# EAGLE design transmitter (EAGLE 6.2)
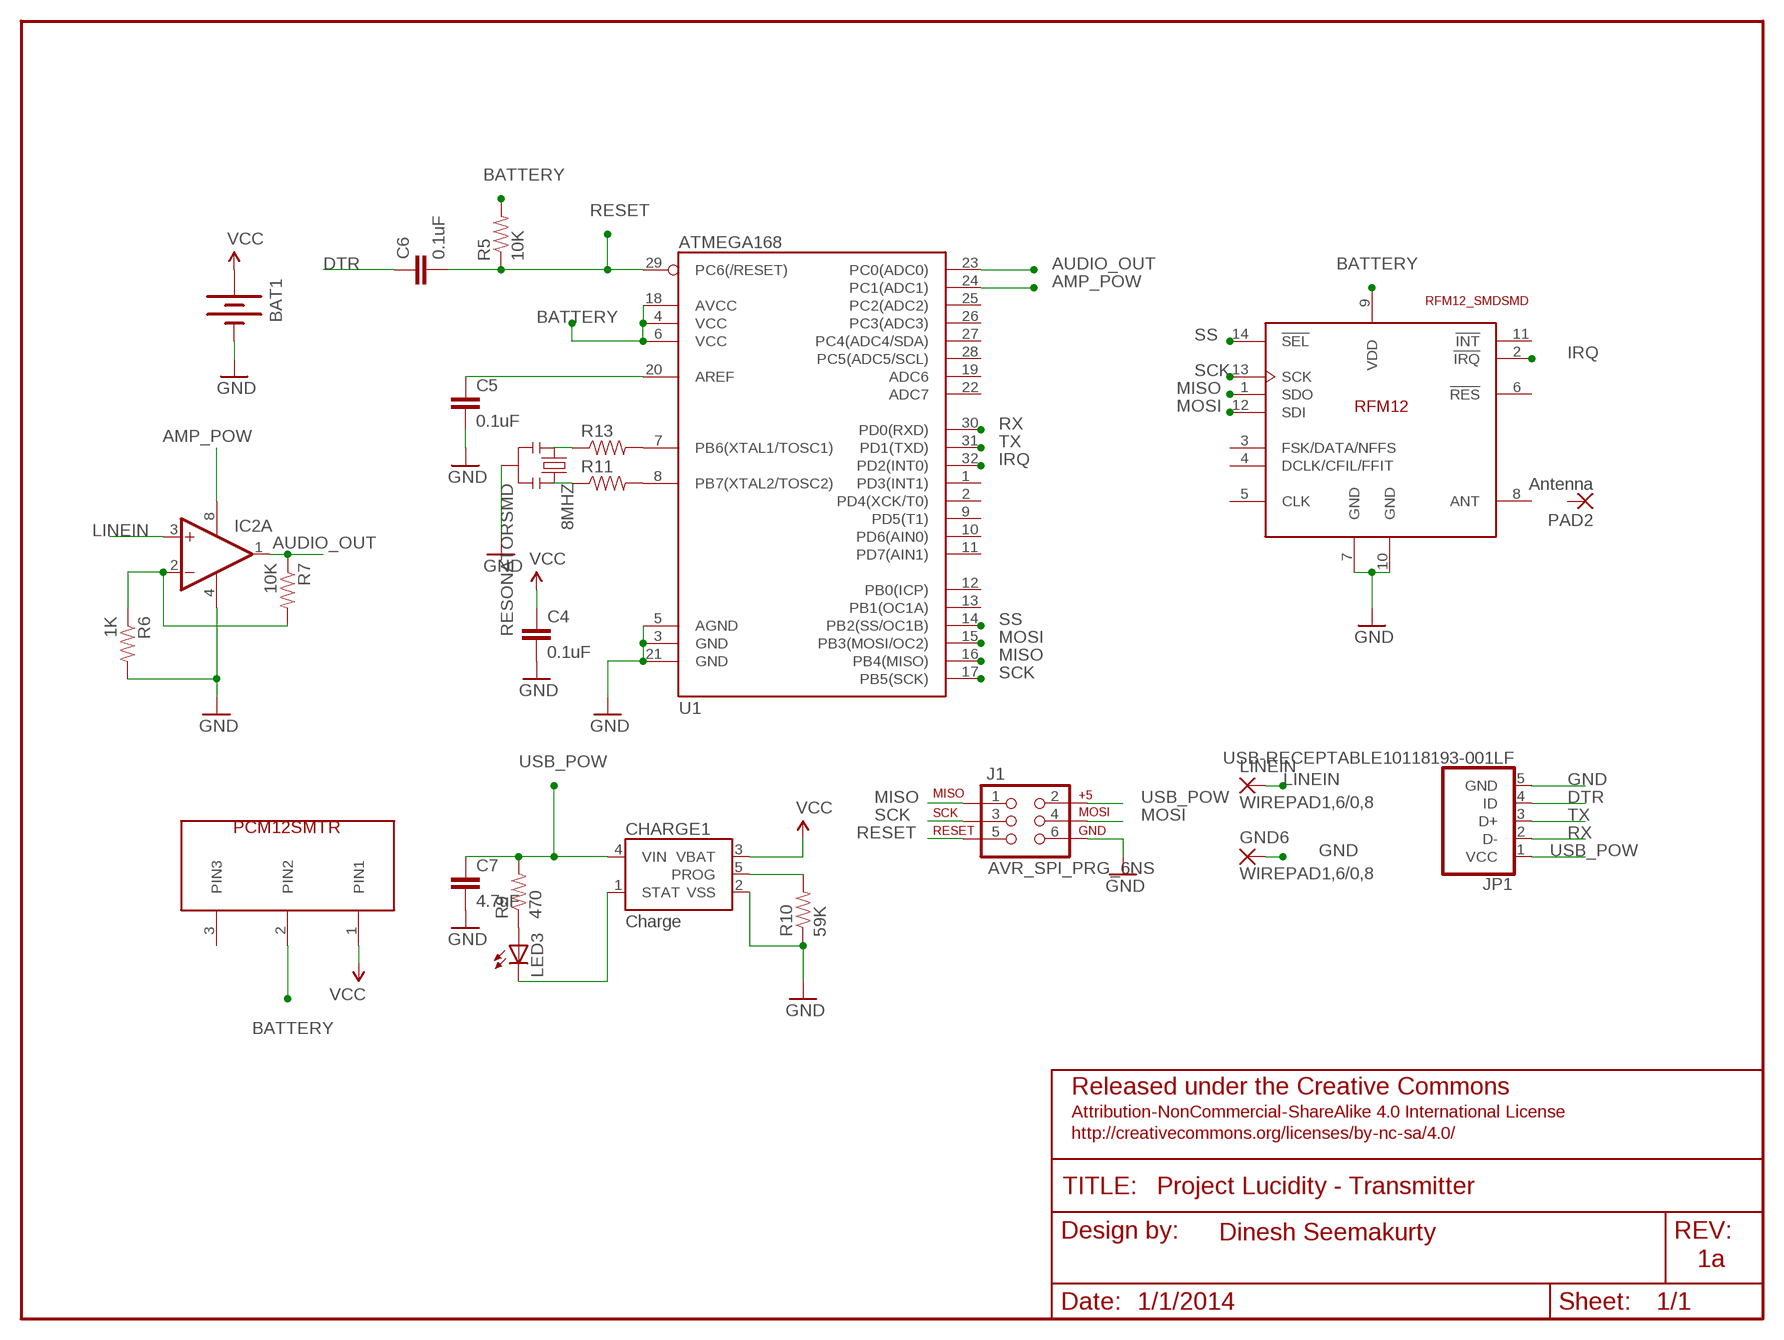
[diagram p0: schematic, sheet 1]

## Parts
8MHZ  RESONATORSMD  [RESONATOR-SMD]
BAT1  BATTERY20MM_4LEGS  [BATTCON_20MM_4LEGS]
C4  0.1uF  CAP0805  [0805]
C5  0.1uF  CAP0805  [0805]
C6  0.1uF  CAP0805  [0805]
C7  4.7uF  CAP0805  [0805]
CHARGE1  Charge  MCP73831  [SOT23-5]
FRAME1  FRAME-LETTER  [CREATIVE_COMMONS]
GND6  WIREPAD1,6/0,8  [1,6/0,8]
IC2  LM358D  [SO08]
J1  AVR_SPI_PRG_6NS  [2X3-NS]
JP1  USB-RECEPTABLE10118193-001LF  [FCI-10118193-0001LF]
LED3  LED0603  [LED-0603]
LINEIN  WIREPAD1,6/0,8  [1,6/0,8]
PAD2  Antenna  WIREPADSMD1,27-254  [SMD1,27-2,54]
R5  10K  RESISTOR0805-RES  [0805]
R6  1K  RESISTOR0805-RES  [0805]
R7  10K  RESISTOR0805-RES  [0805]
R9  470  RESISTOR0805-RES  [0805]
R10  59K  RESISTOR0805-RES  [0805]
R11  RESISTOR0402-RES  [0402-RES]
R13  RESISTOR0402-RES  [0402-RES]
U1  ATMEGA168  [TQFP32-08]
U$2  PCM12SMTR  [PCM12SMTR]
U$3  RFM12_SMDSMD  [RFM12]

## Nets
AMP_POW: IC2.8(P:V+) U1.24(PC1(ADC1))
AUDIO_OUT: IC2.1(A:OUT) R7.1 U1.23(PC0(ADC0))
BATTERY: R5.2 U1.4(VCC) U1.6(VCC) U1.18(AVCC) U$2.2(PIN2) U$3.9(VDD)
DTR: C6.1 JP1.4(ID)
GND: 8MHZ.2 BAT1.GND(-) C4.2 C5.2 C7.2 CHARGE1.2(VSS) GND6.1(P) IC2.4(P:V-) J1.6 JP1.5(GND) R6.2 R10.1 U1.3(GND) U1.5(AGND) U1.21(GND) U$3.7(GND) U$3.10(GND)
IRQ: U1.32(PD2(INT0)) U$3.2(!IRQ)
LINEIN: IC2.3(A:+IN) LINEIN.1(P)
MISO: J1.1 U1.16(PB4(MISO)) U$3.1(SDO)
MOSI: J1.4 U1.15(PB3(MOSI/OC2)) U$3.12(SDI)
N$1: R13.2 U1.7(PB6(XTAL1/TOSC1))
N$15: C5.1 U1.20(AREF)
N$25: R11.2 U1.8(PB7(XTAL2/TOSC2))
N$26: LED3.A R9.1
N$28: IC2.2(A:-IN) R6.1 R7.2
N$29: CHARGE1.1(STAT) LED3.C
N$30: CHARGE1.5(PROG) R10.2
N$31: 8MHZ.1 R13.1
N$32: 8MHZ.3 R11.1
RESET: C6.2 J1.5 R5.1 U1.29(PC6(/RESET))
RX: JP1.2(D-) U1.30(PD0(RXD))
SCK: J1.3 U1.17(PB5(SCK)) U$3.13(SCK)
SS: U1.14(PB2(SS/OC1B)) U$3.14(!SEL)
TX: JP1.3(D+) U1.31(PD1(TXD))
USB_POW: C7.1 CHARGE1.4(VIN) J1.2 JP1.1(VCC) R9.2
VCC: BAT1.POW1(+) BAT1.POW2(+) BAT1.POW3(+) BAT1.POW4(+) C4.1 CHARGE1.3(VBAT) U$2.1(PIN1)
Unconnected: IC2.5(B:+IN) IC2.6(B:-IN) IC2.7(B:OUT) PAD2.1(P) U1.1(PD3(INT1)) U1.2(PD4(XCK/T0)) U1.9(PD5(T1)) U1.10(PD6(AIN0)) U1.11(PD7(AIN1)) U1.12(PB0(ICP)) U1.13(PB1(OC1A)) U1.19(ADC6) U1.22(ADC7) U1.25(PC2(ADC2)) U1.26(PC3(ADC3)) U1.27(PC4(ADC4/SDA)) U1.28(PC5(ADC5/SCL)) U$2.3(PIN3) U$3.3(FSK/DATA/NFFS) U$3.4(DCLK/CFIL/FFIT) U$3.5(CLK) U$3.6(!RES) U$3.8(ANT) U$3.11(!INT)

## Notes on the sheet
- Released under the Creative Commons
- Attribution-NonCommercial-ShareAlike 4.0 International License
- http://creativecommons.org/licenses/by-nc-sa/4.0/
- Project Lucidity - Transmitter
- Dinesh Seemakurty
- 1a
- 1/1/2014

## Library data of the parts
8MHZ = SparkFun-FreqCtrl:RESONATOR: Resonator Small SMD resonator. This is the itty bitty 10/20MHz resonators with built in caps. CSTCE10M0G55 and CSTCE20M0V53. Footprint has been reviewed closely but hasn't been tested yet.
BAT1 = SparkFunEdits:BATTERY: Battery Holders Various common sizes : AA, AAA, 20mm coin cell and 12mm coin cell.
C4-C7 = SparkFun-Passives:CAP: Capacitor Standard 0603 ceramic capacitor, and 0.1" leaded capacitor.
CHARGE1 = SparkFun-PowerIC:MCP73831: Miniature single cell, fully integrated Li-Ion, Li-polymer charge management controller http://ww1.microchip.com/downloads/en/DeviceDoc/21984a.pdf
FRAME1 = test:FRAME-LETTER: Schematic Frame Standard 8.5x11 US Letter frame
GND6 LINEIN PAD2 = wirepad:WIREPAD: Wire PAD connect wire on PCB
IC2 = linear:LM358: OP AMP also LM158; LM258; LM2904 Source: http://cache.national.com/ds/LM/LM158.pdf
J1 = Dinesh Custom:AVR_SPI_PRG_6: AVR ISP 6 Pin This is the reduced ISP connector for AVR programming. Common on Arduino. This footprint will take up less PCB space and can be used with a 10-pin to 6-pin adapter such as SKU: BOB-08508
JP1 = Dinesh Custom:USB-RECEPTABLE: USB Receptable
LED3 = SparkFun-LED:LED: LEDs Standard schematic elements and footprints for 5mm, 3mm, 1206, and 0603 sized LEDs. 5mm - Spark Fun Electronics SKU : COM-00529 (and others)
R5-R7 R9-R11 R13 = SparkFun-Passives:RESISTOR: Resistor Basic schematic elements and footprints for 0603, 1206, and PTH resistors.
U1 = SparkFun-DigitalIC:ATMEGA168: Atmel 32-pin 8-bit micro, 16k flash.
U$2 = Dinesh Custom:PCM12SMTR
U$3 = rfm_12:RFM12_SMD: RFM12 is a low costing ISM band transceiver module implemented with unique PLL. It works signal ranges from 315/433/868/915MHZ bands, comply with FCC, ETSI regulation. The SPI interface is used to communicate with microcontroller for parameter setting.

## Board
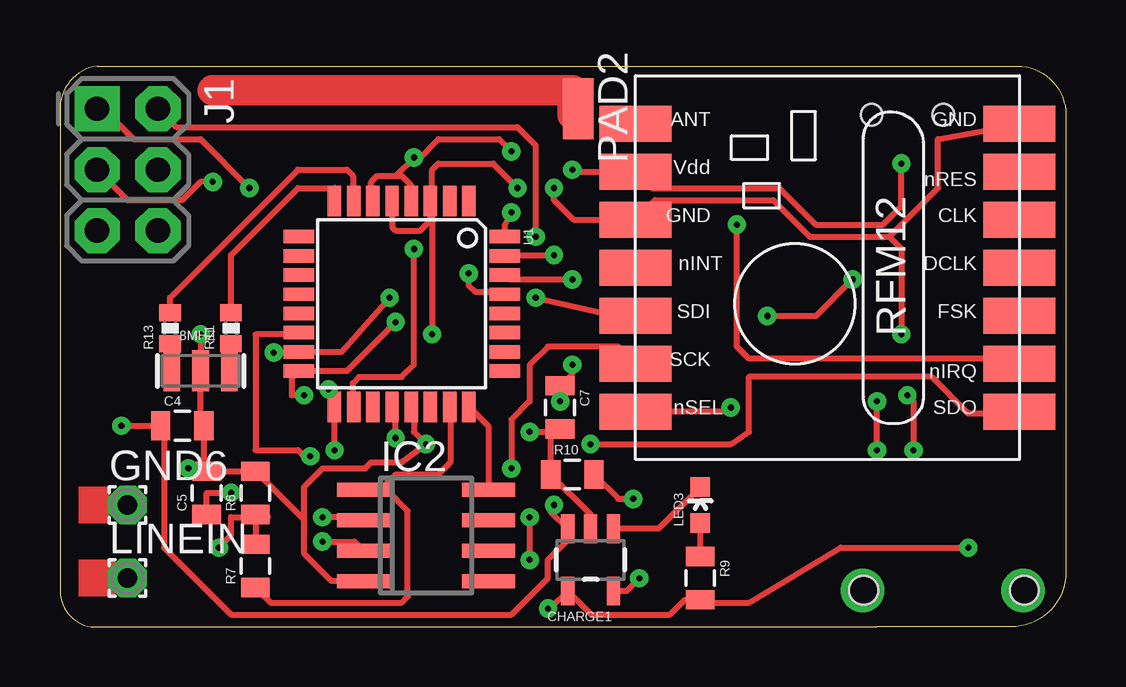
[diagram p1: board, top side]
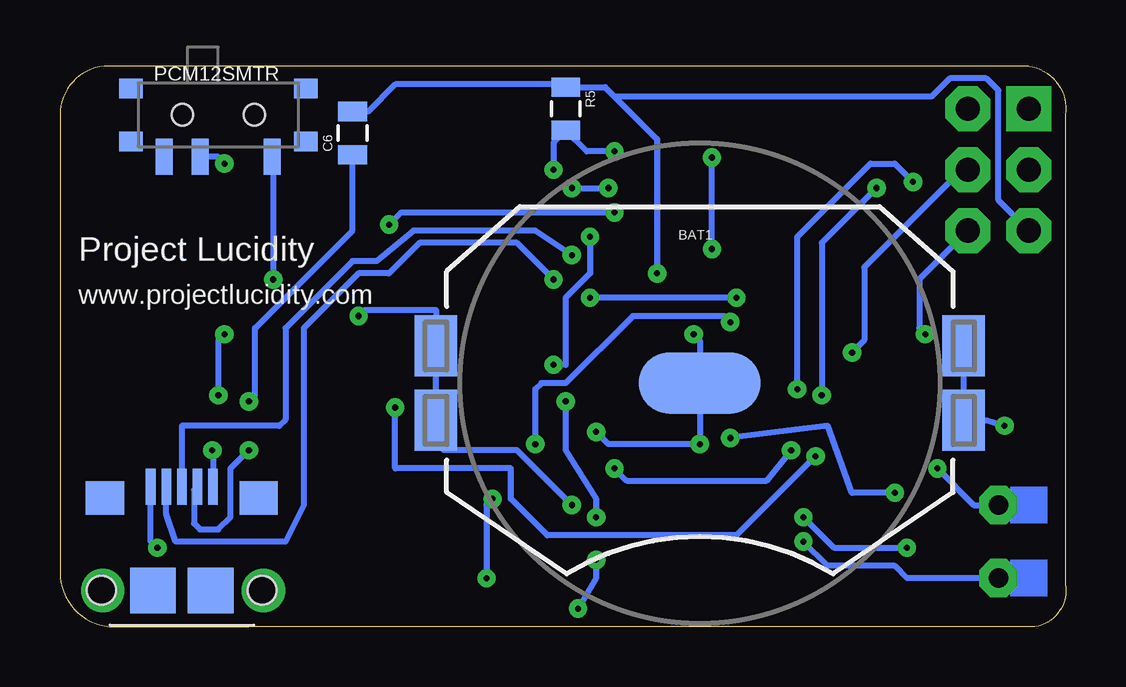
[diagram p2: board, bottom side, seen from below]

Size 41.93 x 23.37 mm. Coordinates in mm from the lower left corner, seen from the top.
Outline: 33.8,23.37 1.54,23.37 arc90 0.02,21.34 0.02,2.29 0.02,1.78 arc90 1.29,0 33.8,0 34.06,0 39.64,0 arc90 41.93,2.29 41.93,21.34 arc90 39.9,23.37 33.8,23.37
Outline: 33.8,23.37 34.06,23.37
Copper layers (1*16): Top 0.035mm / dielectric 1.5mm / Bottom 0.035mm
Design rules: minimum track width 8mil, minimum drill 20mil, track to track 8mil, track to pad 8mil, pad to pad 8mil, via to via 8mil, smd to smd 8mil, copper to edge 10mil, drill to drill 8mil, minimum pad ring 12mil, minimum via ring 10mil, stop-mask expansion 4mil, vias tented up to drill 25mil, thermal gap 10mil

### Footprints (pad centres in the part's own frame; a part is rotated, then mirrored left to right if it is on the bottom)
RESONATOR-SMD = smd 0.7 x 1.7: 1 -1.2,0; 2 0,0; 3 1.2,0
BATTCON_20MM_4LEGS = smd 5.08 x 2.54: GND 0,0 | smd 1.778 x 2.54: POW1 -11,1.55; POW2 -11,-1.55; POW3 11,1.55; POW4 11,-1.55
0805 = smd 0.8 x 1.2: 1 -0.9,0; 2 0.9,0
SOT23-5 = smd 0.55 x 1.2: 1 -0.95,-1.3; 2 0,-1.3; 3 0.95,-1.3; 4 0.95,1.3; 5 -0.95,1.3
1,6/0,8 = drill 0.813 pad 1.6 octagon: 1 0,0
SO08 = smd 0.6 x 2.2: 1 -1.905,-2.6; 2 -0.635,-2.6; 3 0.635,-2.6; 4 1.905,-2.6; 5 1.905,2.6; 6 0.635,2.6; 7 -0.635,2.6; 8 -1.905,2.6
2X3-NS = drill 1.016 pad 1.88 square: 1 -2.54,-1.27 | drill 1.016 pad 1.88 octagon: 2 -2.54,1.27; 3 0,-1.27; 4 0,1.27; 5 2.54,-1.27; 6 2.54,1.27
FCI-10118193-0001LF = smd 0.4 x 1.5: 1 -1.3,4.325; 2 -0.65,4.325; 3 0,4.325; 4 0.65,4.325; 5 1.3,4.325 | smd 1.6 x 1.4: P$6 3.2,3.85; P$7 -3.2,3.85 | smd 1.9 x 1.9: P$8 -1.2,0; P$9 1.2,0 | drill 1.2: P$10 -3.3,0; P$11 3.4,0 | hole 1.2: -3.35,0; 3.35,0
LED-0603 = smd 0.8 x 0.8: A 0,-0.75; C 0,0.75
SMD1,27-2,54 = smd 1.27 x 2.54: 1 0,0
0402-RES = smd 0.7 x 0.9: 1 -0.65,0; 2 0.65,0
TQFP32-08 = smd 1.27 x 0.559: 1 -4.293,2.8; 2 -4.293,2; 3 -4.293,1.2; 4 -4.293,0.4; 5 -4.293,-0.4; 6 -4.293,-1.2; 7 -4.293,-2; 8 -4.293,-2.8; 17 4.293,-2.8; 18 4.293,-2; 19 4.293,-1.2; 20 4.293,-0.4; 21 4.293,0.4; 22 4.293,1.2; 23 4.293,2; 24 4.293,2.8 | smd 0.559 x 1.27: 9 -2.8,-4.293; 10 -2,-4.293; 11 -1.2,-4.293; 12 -0.4,-4.293; 13 0.4,-4.293; 14 1.2,-4.293; 15 2,-4.293; 16 2.8,-4.293; 25 2.8,4.293; 26 2,4.293; 27 1.2,4.293; 28 0.4,4.293; 29 -0.4,4.293; 30 -1.2,4.293; 31 -2,4.293; 32 -2.8,4.293
PCM12SMTR = smd 0.711 x 1.499: 1 -2.235,1.74; 2 0.762,1.74; 3 2.261,1.74 | smd 0.991 x 0.813: SUPPORT1 -3.645,1.105; SUPPORT2 -3.645,-1.105; SUPPORT3 3.645,1.105; SUPPORT4 3.645,-1.105 | hole 0.889: -1.499,0; 1.499,0
RFM12 = smd 1.5 x 3: 1 -5,-10; 2 -3,-10; 3 -1,-10; 4 1,-10; 5 3,-10; 6 5,-10; 7 7,-10; 8 7,6; 9 5,6; 10 3,6; 11 1,6; 12 -1,6; 13 -3,6; 14 -5,6

### Placement (x,y rotation side)
8MHZ  5.86,10.67 0 top
BAT1  15.26,10.16 0 bottom
C4  5.1,8.38 0 top
C5  6.12,5.59 90 top
C6  29.74,20.57 90 bottom
C7  20.85,9.14 270 top
CHARGE1  22.12,2.79 180 top
FRAME1  18.82,-7.87 0 top  (outside the outline)
GND6  2.81,5.08 0 top
IC2  15.26,3.81 270 top
J1  2.81,19.05 270 top
JP1  36.85,1.52 0 bottom
LED3  26.69,5.08 0 top
LINEIN  2.81,2.03 0 top
PAD2  21.61,21.59 180 top
R5  20.85,21.59 270 bottom
R6  8.15,5.59 90 top
R7  8.15,2.54 90 top
R9  26.69,2.03 270 top
R10  21.36,6.35 0 top
R11  7.13,12.45 90 top
R13  4.59,12.45 90 top
U1  14.24,13.46 270 top
U$2  35.33,21.34 180 bottom
U$3  29.99,13.97 90 top

### Tracks (layer width: path | path; a pad name or v marks a point on that pad's centre or on a via)
AMP_POW
  Top 0.254: U1.24 17.86,8.35 IC2.8
AUDIO_OUT
  Top 0.254: R7.1 8.77,1.02 14.24,1.02 14.5,1.27 14.5,4.83 13.61,5.71 13.36,5.71 | 13.36,5.71 IC2.1 | U1.23 16.28,9.14 16.28,6.86 15.77,6.35 13.99,6.35 13.36,5.71
BATTERY  (via drill 0.25)
  Top 0.254: v21.36,19.05 21.44,18.97 U$3.9 24.67,18.29 29.99,18.29 31.52,16.76 34.31,16.76 35.07,17.53 v35.07,19.3 | U1.6 12.97,17.82 12.97,18.54 13.23,18.8 13.99,18.8 | 13.99,18.8 14.24,18.8 14.64,18.4 U1.4 | U1.18 12.21,9.2 12.21,10.16 12.47,10.41 14.24,10.41 14.75,10.92 v14.75,15.75 | 13.99,18.8 v14.75,19.56 15.01,19.56 15.77,20.32 18.31,20.32 v18.82,19.81
  Bottom 0.254: v21.36,19.05 21.36,20.18 R5.2 19.97,19.81 v18.82,19.81 | v35.07,19.3 35.36,19.6 U$2.2 | v14.75,15.75 v14.75,19.56
DTR  (via drill 0.25)
  Top 0.254: v34.06,7.37 v34.06,9.4
  Bottom 0.254: JP1.4 36.34,5.71 36.34,4.32 36.09,4.06 35.33,4.06 34.82,4.57 34.82,6.6 v34.06,7.37 | v34.06,9.4 33.8,9.65 33.8,12.45 29.74,16.51 C6.1
GND  (via drill 0.25)
  Top 0.254: 6,6.49 C5.2 R6.2 10.18,4.46 | 6,6.49 C4.2 5.86,8.52 8MHZ.2 v5.86,12.19 | CHARGE1.2 22.12,4.69 R10.1 20.46,7.85 C7.2 20.73,8.13 v19.58,8.13 | U1.3 15.51,17.82 15.51,19.05 15.77,19.3 18.05,19.3 v19.07,18.29 | 6,6.49 5.88,6.6 v5.35,6.6 | 34.56,16.26 31.26,16.26 29.74,17.78 24.8,17.78 U$3.10 21.4,16.97 20.59,17.78 v20.59,18.29 | 34.56,16.26 36.6,18.29 36.6,20.32 38.77,20.72 U$3.7 | 34.56,16.26 35.07,15.75 v35.07,12.19 | v35.33,9.65 35.58,9.4 v35.58,7.37 | IC2.4 11.32,1.91 10.18,3.05 10.18,4.46 | 10.18,4.46 10.18,5.84 10.94,6.6 12.72,6.6 12.97,6.86 14.24,6.86 v15.26,7.62 14.75,8.13 14.75,9.31 U1.21 | U1.5 13.84,16.66 13.99,16.51 15.01,16.51 15.44,16.95 U1.3 | U1.3 15.51,17.68 v15.51,12.19
  Bottom 0.254: v5.35,6.6 3.83,5.08 GND6.1 | v35.07,12.19 35.33,11.94 v35.33,9.65 | v35.58,7.37 35.55,7.34 JP1.5 | v19.58,8.13 19.07,7.62 v15.26,7.62 BAT1.GND 15.26,11.94 v15.51,12.19 | v20.59,18.29 v19.07,18.29 | v5.86,12.19 6.12,12.45 6.12,14.48 J1.6
IRQ  (via drill 0.25)
  Top 0.254: U$3.2 39.79,11.18 28.72,11.18 28.21,11.68 v28.21,16.76 | v18.82,17.27 18.54,16.74 U1.32
  Bottom 0.254: v28.21,16.76 27.71,17.27 v18.82,17.27
LINEIN  (via drill 0.25)
  Top 0.254: v10.94,3.56 12.28,3.56 IC2.3
  Bottom 0.254: LINEIN.1 6.62,2.03 7.13,2.54 9.93,2.54 v10.94,3.56
MISO  (via drill 0.25)
  Top 0.254: U$3.1 39.91,8.89 37.87,8.89 36.34,10.41 28.72,10.41 28.72,8.13 27.96,7.62 v22.12,7.62 | v13.99,12.7 11.96,10.67 U1.16 9.67,10.38 9.67,9.65 v10.18,9.65 | J1.1 1.8,21.59 3.07,20.32 5.86,20.32 v7.89,18.29
  Bottom 0.254: v13.99,12.7 14.24,12.95 18.05,12.95 20.85,10.16 21.86,10.16 22.12,9.91 v22.12,7.62 | v7.89,18.29 10.18,16 v10.18,9.65
MOSI  (via drill 0.25)
  Top 0.254: v13.74,13.72 11.74,11.46 U1.15 9.92,11.43 v8.91,11.43 | v19.83,13.72 23.25,12.95 U$3.12
  Bottom 0.254: v13.74,13.72 v19.83,13.72 | J1.4 4.34,19.05 8.4,14.99 8.4,11.94 v8.91,11.43
N$1
  Top 0.254: R13.2 4.59,13.72 9.93,19.05 11.96,19.05 12.21,18.8 12.21,17.79 U1.7
N$2
  Top 1.27: 21.36,21.34 21.36,22.35 6.37,22.35
N$15  (via drill 0.25)
  Top 0.254: C5.1 6.12,5.59 v7.13,5.59 | v13.99,7.87 13.99,9.06 U1.20
  Bottom 0.254: v7.13,5.59 8.91,5.59 9.93,8.38 v13.99,7.87
N$25
  Top 0.254: R11.2 7.13,15.49 9.93,18.29 11.45,18.29 U1.8
N$26
  Top 0.254: R9.1 LED3.A
N$28  (via drill 0.25)
  Top 0.254: R7.2 R6.1 8.26,4.57 | IC2.2 12.53,4.57 v10.94,4.57 | v6.62,3.3 7.13,3.81 7.13,4.57 8.26,4.57 | 8.26,4.57 8.66,4.57
  Bottom 0.254: v10.94,4.57 9.67,3.3 v6.62,3.3
N$29
  Top 0.254: LED3.C 24.95,4.09 CHARGE1.1
N$30  (via drill 0.25)
  Top 0.254: R10.2 23.27,5.33 v23.9,5.33 | v24.15,2.03 23.61,1.49 CHARGE1.5
  Bottom 0.254: v23.9,5.33 24.15,5.08 v24.15,2.03
N$31
  Top 0.254: R13.1 4.85,11.8 4.85,11.43 4.66,11.43 8MHZ.1
N$32
  Top 0.254: R11.1 7.06,11.8 8MHZ.3
RESET  (via drill 0.25)
  Top 0.254: v17.04,14.73 17.04,14.22 17.29,13.97 18.43,13.97 U1.29
  Bottom 0.254: C6.2 29.09,21.47 27.96,22.61 20.96,22.61 R5.1 19.21,22.49 18.82,22.1 | 18.82,22.1 17.04,20.32 v17.04,14.73 | J1.5 2.81,17.78 2.81,22.35 3.32,22.86 4.85,22.86 5.61,22.1 18.82,22.1
RX  (via drill 0.25)
  Top 0.254: U1.30 18.72,14.48 v21.36,14.48
  Bottom 0.254: v21.36,14.48 22.88,16 26.94,16 28.21,14.73 29.48,14.73 31.77,12.45 31.77,5.08 32.53,3.56 37.1,3.56 37.5,4.71 JP1.2
SCK  (via drill 0.25)
  Top 0.254: U$3.13 23.28,11.68 20.34,11.68 19.58,10.92 19.58,9.4 18.82,8.64 v18.82,6.6 | v11.45,7.37 11.44,7.12 U1.17 11.44,9.9 v11.2,9.91 | v6.37,18.54 5.86,18.54 5.1,17.78 2.81,17.78 J1.3
  Bottom 0.254: v18.82,6.6 18.31,6.1 12.47,6.1 v11.45,7.37 | v11.2,9.91 11.2,16.26 8.15,19.3 7.13,19.3 v6.37,18.54
SS  (via drill 0.25)
  Top 0.254: U1.14 9.88,12.19 8.15,12.19 8.15,7.37 9.93,7.37 10.18,7.11 v10.43,7.11 | v27.96,9.14 27.79,8.97 U$3.14
  Bottom 0.254: v10.43,7.11 13.74,3.81 21.61,3.81 23.13,5.33 23.13,6.6 27.96,6.6 v27.96,9.14
TX  (via drill 0.25)
  Top 0.254: U1.31 18.57,15.49 v20.59,15.49
  Bottom 0.254: v20.59,15.49 22.12,16.51 27.2,16.51 28.72,15.24 29.74,15.24 32.53,12.45 32.53,8.64 32.79,8.38 36.85,8.38 JP1.3
USB_POW  (via drill 0.25)
  Top 0.254: 26.07,1.13 R9.2 | R9.2 26.04,1.13 25.42,0.51 22.15,0.51 CHARGE1.4 20.44,0.76 v20.34,0.76 | v20.85,9.4 C7.1 21.36,10.55 v21.36,10.92 | R9.2 26.81,1.02 28.72,1.02 32.53,3.3 v37.87,3.3 | v19.58,4.57 v19.58,2.79 | J1.2 4.85,20.83 19.07,20.83 19.83,20.07 v19.83,16.26
  Bottom 0.254: v20.85,9.4 20.85,7.37 19.58,5.33 v19.58,4.57 | v20.34,0.76 19.58,2.03 v19.58,2.79 | v37.87,3.3 38.15,3.59 JP1.1 | v19.83,16.26 19.83,14.73 20.85,13.72 20.85,10.92 v21.36,10.92
VCC  (via drill 0.25)
  Top 0.254: v20.59,5.08 20.44,4.83 CHARGE1.3 21.17,3.62 20.34,2.79 20.34,2.03 18.82,0.51 7.13,0.51 4.34,3.3 4.34,8.24 C4.1 v2.56,8.38 | v33.04,14.48 31.52,12.95 v29.48,12.95
  Bottom 0.254: v20.59,5.08 22.88,7.37 25.93,7.37 26.26,7.7 BAT1.POW2 BAT1.POW1 26.26,13.21 29.23,13.21 v29.48,12.95 | U$2.1 33.04,19.55 v33.04,14.48 | BAT1.POW3 BAT1.POW4 3.3,8.61 v2.56,8.38
(copper drawn outside any net)
  shapes: Bottom area x2, Top area x2

### Text on the board
tNames: Dinesh Seemakurty
bNames: Project Lucidity | www.projectlucidity.com